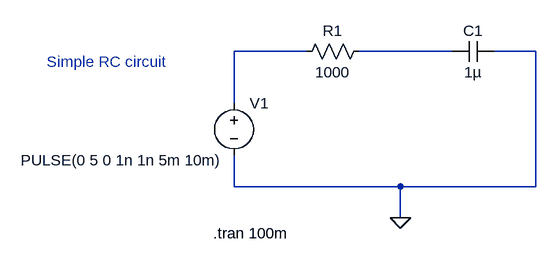
[diagram p0: schematic Simple RC circuit.asc]
Simple RC circuit.asc, the LTspice schematic file:
Version 4
SHEET 1 880 680
WIRE 128 128 16 128
WIRE 352 128 208 128
WIRE 480 128 416 128
WIRE 16 208 16 128
WIRE 16 336 16 288
WIRE 272 336 16 336
WIRE 480 336 480 128
WIRE 480 336 272 336
WIRE 272 384 272 336
FLAG 272 384 0
SYMBOL res 224 112 R90
WINDOW 0 0 56 VBottom 2
WINDOW 3 32 56 VTop 2
SYMATTR InstName R1
SYMATTR Value 1000
SYMBOL cap 416 112 R90
WINDOW 0 0 32 VBottom 2
WINDOW 3 32 32 VTop 2
SYMATTR InstName C1
SYMATTR Value 1µ
SYMBOL voltage 16 192 R0
WINDOW 3 -328 103 Left 2
WINDOW 123 0 0 Left 0
WINDOW 39 0 0 Left 0
SYMATTR InstName V1
SYMATTR Value PULSE(0 5 0 1n 1n 5m 10m)
TEXT -16 408 Left 2 !.tran 100m
TEXT -272 144 Left 2 ;Simple RC circuit

The netlist it stands for:
* Simple RC circuit.asc
R1 N002 N001 1000
C1 0 N002 1µ
V1 N001 0 PULSE(0 5 0 1n 1n 5m 10m)
.tran 100m
* Simple RC circuit
.backanno
.end